# EAGLE schematic School System PCB (EAGLE 7.6.0)
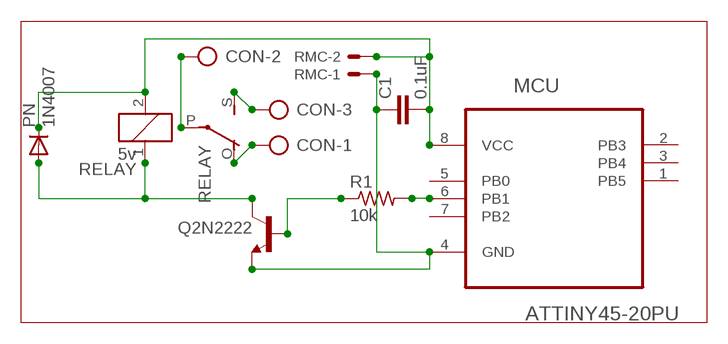
[diagram p0: schematic, sheet 1]

## Parts
C1  0.1uF  C2,5-3  [C2.5-3]
CON  AK300/3  [AK300/3]
MCU  ATTINY45-20PU  [DIP254P762X533-8]
PN  1N4007  1N4004  [DO41-10]
Q2N2222  2N2222-NPN-TO92-EBC  [TO92-EBC]
R1  10k  R-US_0204/7  [0204/7]
RELAY  5v  ZF112  [ZF112]
RMC  22-23-2021  [22-23-2021]

## Nets
N$1: Q2N2222.B R1.1
N$2: C1.1 MCU.4(GND) Q2N2222.E RMC.1
N$3: MCU.6(PB1) R1.2
N$5: PN.A Q2N2222.C RELAY.1
N$6: C1.2 MCU.8(VCC) PN.C RELAY.2 RMC.2
N$7: CON.2 RELAY.P(2:P)
N$8: CON.3 RELAY.S(2:S)
N$9: CON.1 RELAY.O(2:O)
Unconnected: MCU.1(PB5) MCU.2(PB3) MCU.3(PB4) MCU.5(PB0) MCU.7(PB2)

## Library data of the parts
C1 = capacitor-wima:C: CAPACITOR naming: grid - package width
CON = con-ptr500:AK300/3: CONNECTOR; OC_FARNELL: unknown; OC_NEWARK: unknown
MCU = Atmel_By_element14_Batch_1-00:ATTINY45-20PU: 8-bit Microcontroller with 2/4/8KBytes In-System Programmable Flash; MPN: ATTINY45-20PU; OC_FARNELL: 1288352; OC_NEWARK: 23M5072; PACKAGE: PDIP-8; SUPPLIER: Atmel
PN = diode:1N4004: DIODE general purpose rectifier, 1 A
Q2N2222 = transistor-neu-to92:*-NPN-: NPN Transistror
R1 = resistor:R-US_: RESISTOR, American symbol
RELAY = relay:ZF112: RELAY 1 x switch; OC_FARNELL: unknown; OC_NEWARK: unknown
RMC = con-molex:22-23-2021: .100" (2.54mm) Center Header - 2 Pin; MF: MOLEX; MPN: 22-23-2021; OC_FARNELL: 1462926; OC_NEWARK: 25C3832